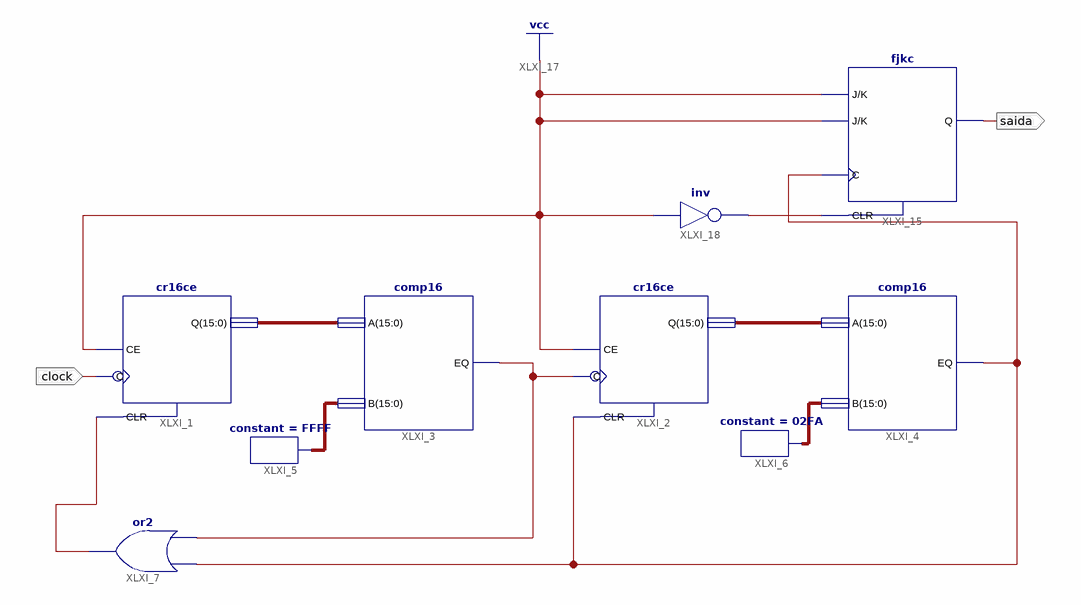
[diagram p0: schematic sheet 1]
// Xilinx ISE schematic DivisorFrequencia.sch (spartan3) as structural Verilog: 9 symbols, 2 ports
module DivisorFrequencia (
  input  clock,
  output saida
);

  wire XLXN_3, XLXN_7, XLXN_21, XLXN_22;
  wire [15:0] XLXN_1, XLXN_2, XLXN_4, XLXN_5;

  cr16ce XLXI_1 (.C(clock), .CE(1'b1), .CLR(XLXN_7), .Q(XLXN_1));
  comp16 XLXI_3 (.A(XLXN_1), .B(XLXN_4), .EQ(XLXN_3));
  comp16 XLXI_4 (.A(XLXN_2), .B(XLXN_5), .EQ(XLXN_22));
  cr16ce XLXI_2 (.C(XLXN_3), .CE(1'b1), .CLR(XLXN_22), .Q(XLXN_2));
  constant #(.CValue("FFFF")) XLXI_5 (.O(XLXN_4));
  constant #(.CValue("02FA")) XLXI_6 (.O(XLXN_5));
  or XLXI_7 (XLXN_7, XLXN_3, XLXN_22);
  fjkc XLXI_15 (.C(XLXN_22), .CLR(XLXN_21), .J(1'b1), .K(1'b1), .Q(saida));
  not XLXI_18 (XLXN_21, 1'b1);
endmodule
